# Altium schematic sheet Main.SchDoc
size A; SheetNumber: 1; SheetTotal: 1; SPICEModelCacheQRDTZQRB: <root> / <DocumentId>QRDTZQRB</DocumentId> / <CacheFrame Number="0"> / <Model Name="d_d" Kind="CKT"> / <Text>*$ / .subckt d_d 1 2 / d1 1 2 dd / .model dd d / + is=1e-015 / + n=0.01 / + tt=1e-011 / .ends d_d</Text> / </Model> / <Model Name="tps7a4901_f1" Kind="CKT"> / <Text>*$ / .subckt TPS7A4901_F1 1 2 3 4 / F_F1         3 4 VF_F1 1 / VF_F1         1 2 0V / .ends TPS7A4901_F1</Text> / </Model> / <Model Name="tps7a4901_s2" Kind="CKT"> / <Text>*$ / .subckt TPS7A4901_S2 1 2 3 4 / S_S2         3 4 1 2 _S2 / RS_S2         1 2 1G / .MODEL         _S2 VSWITCH Roff=100 Ron=10 Voff=0.1V Von=0.9V / .ends TPS7A4901_S2</Text> / </Model> / <Model Name="comphys_basic_gen" Kind="CKT"> / <Text>*$ / .SUBCKT COMPHYS_BASIC_GEN INP INM HYS OUT PARAMS: VDD=1 VSS=0 VTHRESH=0.5 / EIN INP1 INM1 INP INM 1 / EHYS INP1 INP2 VALUE { IF( V(1) &gt; {VTHRESH},-V(HYS),0) } / EOUT OUT 0 VALUE { IF( V(INP2)&gt;V(INM1), {VDD} ,{VSS}) } / R1 OUT 1 1 / C1 1 0 5n / RINP1 INP1 0 1K / .ENDS COMPHYS_BASIC_GEN</Text> / </Model> / <Model Name="tps7a4901_trans" Kind="CKT"> / <Text>*$ / *TPS7A4901 / ***************************************************************************** / * (C) Copyright 2017, 2015 Texas Instruments Incorporated. All rights reserved. / ***************************************************************************** / ** This model is designed as an aid for customers of Texas Instruments. / ** TI and its licensors and suppliers make no warranties, either expressed / ** or implied, with respect to this model, including the warranties of / ** merchantability or fitness for a particular purpose. The model is / ** provided solely on an "as is" basis. The entire risk as to its quality / ** and performance is with the customer. / ***************************************************************************** / * / ** Released by: WEBENCH Design Center, Texas Instruments Inc. / * Part: TPS7A4901 / * Date: 28FEB2017 / * Model Type: Transient / * Simulator: PSPICE / * Simulator Version: 16.2.0.p001 / * EVM Order Number: TPS7A30-49EVM-567 / * EVM Users Guide:  SLVU405â€“August 2010 / * Datasheet: SBVS121E â€“AUGUST 2010â€“REVISED MAY 2015 / * / * Model Version: Final 1.2 / * / ***************************************************************************** / * / * Updates:1.2 / *&lt;Made this change to the model&gt; / *          1. Model has been updated to support for inverting configuration. / * / * / * Final 1.1 / * Released to Web / * Updates:1.1 / *&lt;Made this change to the model&gt; / *          1. The model has been updated using New template. / *          2. Dropout measurement done with respect to IOUT / * Final 1.00 / * Released to Web / * / ***************************************************************************** / .SUBCKT TPS7A4901_TRANS  PwPd EN FB IN NC NR DNC OUT GND / R_R13         0 PWPD  1e6 / E_ABM1         N799364 0 VALUE { {MIN(V(N798163), (V(Vzz_INT)+(ILIM*ROUT)))} / +  } / V_Vload         VZZ OUT 0Vdc / X_F1    N506750 VZZ N506376 VYY TPS7A4901_F1 / E_E11         V_FBK 0 VALUE { V(FB, GND) } / R_R1         VXX N506376  {RINP} / R_R11         DNC IN  1e6 / R_R2         N506318 VXX  {PSRR*RINP} / R_R12         GND DNC  1e6 / X_S2    N506546 0 IN N506376 TPS7A4901_S2 / C_C1         VXX N506376  {1/(6.28*RINP*POLE)} / R_U1_R9         U1_N7715581 NR  1m / X_U1_U2         IN_PRE U1_N627863 U1_N6278133 U1_UVLO_OK COMPHYS_BASIC_GEN / +  PARAMS: VDD=1 VSS=0 VTHRESH=0.5 / X_U1_U1         EN_INT U1_N628879 U1_N628829 U1_EN_OK COMPHYS_BASIC_GEN PARAMS: / +  VDD=1 VSS=0 VTHRESH=0.5 / C_U1_C4         0 VIN_EN_OK  1u IC=0 / R_U1_R4         U1_N629335 U1_N628541  10 TC=0,0 / R_U1_R8         U1_N769717 NR  280k TC=0,0 / X_U1_U4         U1_N672242 N506318 d_d PARAMS: / E_U1_E5         U1_N769717 GND VALUE { V(U1_N15847249, 0) } / V_U1_V3         U1_N6278133 0 {UHYS} / X_U1_U3         VIN_EN_OK U1_N630277 d_d PARAMS: / V_U1_V1         U1_N628829 0 {EHYS} / C_U1_C2         0 U1_N628541  1n / C_U1_C3         GND N506318  1n IC=0 / V_U1_V4         U1_N627863 0 {UVLO} / V_U1_V5         GND U1_N672242 -5.5m / V_U1_V2         U1_N628879 0 {VENB} / E_U1_E8         U1_DROP 0 TABLE { V(LOAD, 0) } / + ( (0,0) (0.1m,50m) (5m,80m) (10m,100m) (15m,120m) (150m,330m) ) / C_U1_C5         GND U1_N7715581  1n IC=0 TC=0,0 / E_U1_ABM6         U1_N629219 0 VALUE { IF(V(VIN_EN_OK)&gt;0.5, V(U1_NR_INT), 0) / +  } / R_U1_R2         GND U1_N628541  1G / E_U1_ABM5         U1_N629917 0 VALUE { MIN(V(U1_N628541), / + MAX(V(IN_PRE)-V(U1_DROP), 0))   } / E_U1_E6         U1_NR_INT 0 VALUE { V(NR, GND) } / E_U1_ABM9         U1_N630277 0 VALUE { if( V(U1_UVLO_OK) &gt; 0.5 &amp; V(U1_EN_OK) &gt; / +  0.5,1,0)    } / E_U1_ABM4         U1_N629335 0 VALUE { V(U1_N628493) / + * (ABS(V(OUT_INT)) + 1e-6) / + / (ABS(V(V_FBK)) + 1e-6)  } / R_U1_R3         U1_N629219 U1_N628493  {3.333e5*SQRT(TTRN)} TC=0,0 / R_U1_R1         GND U1_N628493  1G / E_U1_E4         U1_N6294851 GND VALUE { V(U1_N629917, 0) } / E_U1_ABM10         U1_N15847249 0 VALUE { IF(V(VIN_EN_OK)&gt;0.5,{VREF},0)    } / R_U1_R6         U1_N630277 VIN_EN_OK  {80/0.693} TC=0,0 / C_U1_C1         0 U1_N628493  {1e-6*SQRT(TTRN)} IC=0 / R_U1_R5         U1_N6294851 N506318  10 TC=0,0 / R_R14         0 PWPD  1e6 / C_C2         VXX N506318  {1/(6.28*PSRR*RINP*ZERO)} / R_R9         NC IN  1e6 / R_R6         N506754 VYY  10 TC=0,0 / E_E6         IN_PRE 0 VALUE { V(IN, GND) } / E_ABM2         LOAD 0 VALUE { I(V_Vload)    } / E_E15         OUT_INT 0 VALUE { V(OUT, GND) } / X_U4         GND OUT d_d PARAMS: / C_C5         N506376 GND  0.5n IC=0 / R_R5         N506750 VYY  {ROUT} / C_C3         GND VYY  1n / R_R8         VIN_EN_OK N506546  10 TC=0,0 / R_R10         GND NC  1e6 / E_E12         N798163 0 VALUE { V(VXX, GND) } / E_E14         VZZ_INT 0 VALUE { V(VZZ, GND) } / E_E5         EN_INT 0 VALUE { V(EN, GND) } / C_C4         0 N506546  1u / E_E13         N506754 GND VALUE { V(N799364, 0) } / .PARAM  psrr=224u uvlo=2.95 venb=2.1 ilim=390m pole=500 zero=100k rinp=1e7 / +  ttrn=1u rout=1m vref=1.192 ehys=1.7 uhys=0.05 / .ENDS TPS7A4901_TRANS</Text> / <Dependency>0\d_d</Dependency> / <Dependency>0\tps7a4901_f1</Dependency> / <Dependency>0\tps7a4901_s2</Dependency> / <Dependency>0\comphys_basic_gen</Dependency> / </Model> / <Model Name="skydiode" Kind="MDL"> / <Text>*Default Schottky Diode / *Schottky Diode Pinout: A,K / .MODEL SKYDIODE D(EG=0.69 XTI=2)</Text> / </Model> / </CacheFrame> / </root>
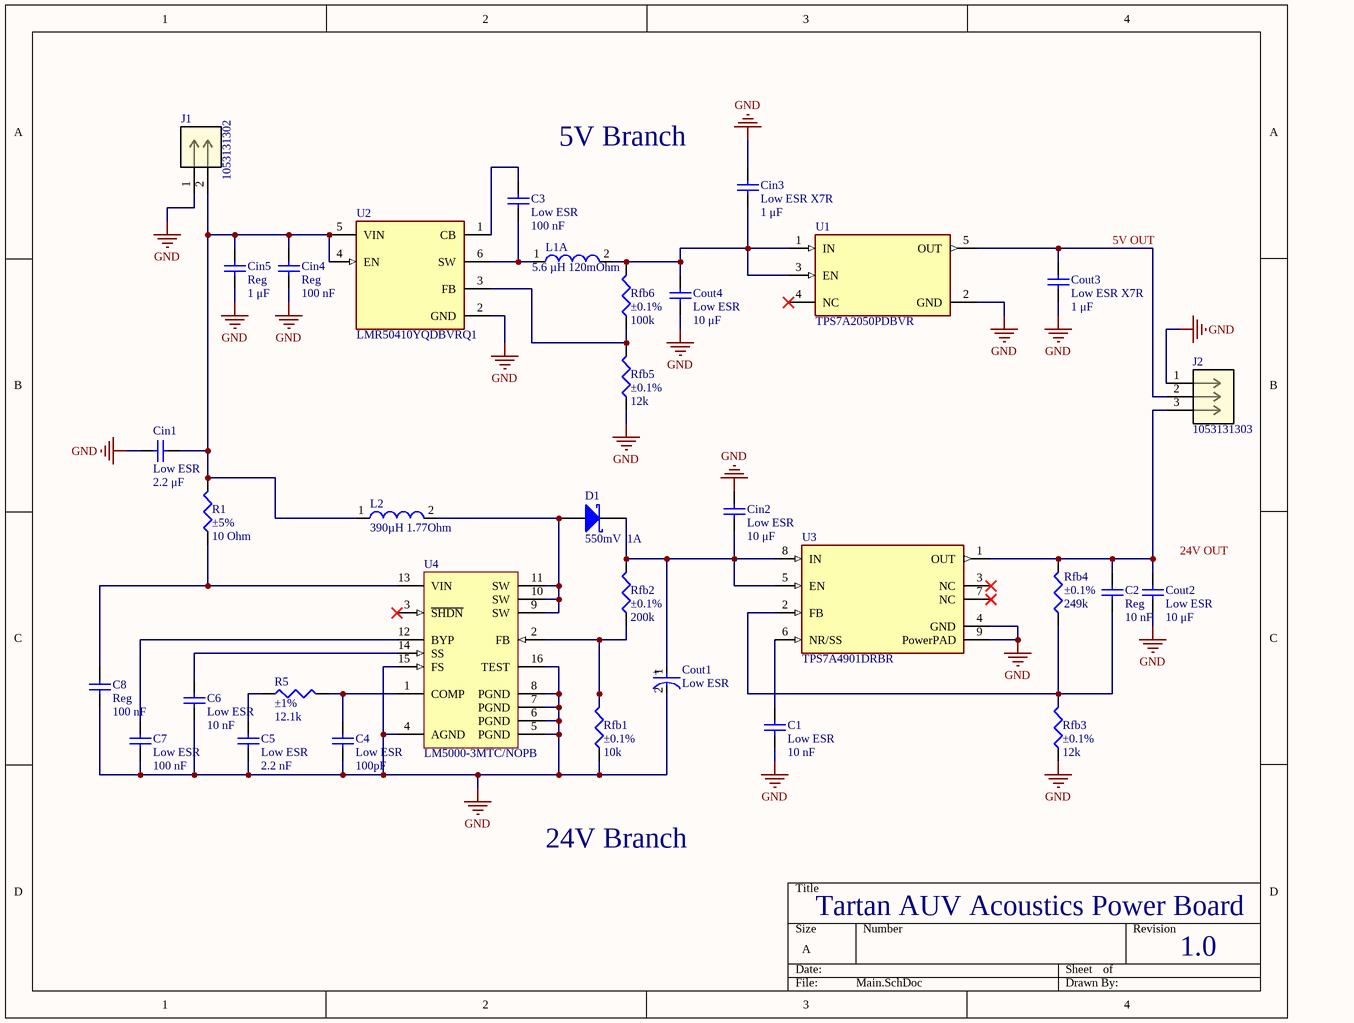
[diagram p0: Main.SchDoc]

## Parts
C1  Low ESR  value 10 nF  [C0805]
C2  Reg  value 10 nF  [C0805]
C3  Low ESR  value 100 nF  [C0805]
C4  Low ESR  value 100pF  [C0805]
C5  Low ESR  value 2.2 nF  [C0805]
C6  Low ESR  value 10 nF  [C0805]
C7  Low ESR  value 100 nF  [C0805]
C8  Reg  value 100 nF  [C0805]
Cin1  Low ESR  value 2.2 μF  [C0805]
Cin2  Low ESR  value 10 μF  [C1210]
Cin3  Low ESR X7R  value 1 μF  [C0805]
Cin4  Reg  value 100 nF  [C0805]
Cin5  Reg  value 1 μF  [C0805]
Cout1  Low ESR  [FP-EEH-D8-MFG]
Cout2  Low ESR  value 10 μF  [C1210]
Cout3  Low ESR X7R  value 1 μF  [C0805]
Cout4  Low ESR  value 10 μF  [C1210]
D1  550mV  1A  [SMB]
J1  1053131302  [CON_1053131302]
J2  1053131303  [CON_1053131303]
L1  5.6 µH 120mOhm  [WE-TPC-8012]  (part A of 2)
L2  390µH 1.77Ohm  [WE-PD2-L]
R1  ±5%  value 10 Ohm  [J1-0603]
R5  ±1%  value 12.1k  [J1-0603]
Rfb1  ±0.1%  value 10k  [J1-0603]
Rfb2  ±0.1%  value 200k  [J1-0603]
Rfb3  ±0.1%  value 12k  [J1-0603]
Rfb4  ±0.1%  value 249k  [J1-0603]
Rfb5  ±0.1%  value 12k  [J1-0603]
Rfb6  ±0.1%  value 100k  [J1-0603]
U1  TPS7A2050PDBVR  [FP-DBV0005A-IPC_B]
U2  LMR50410YQDBVRQ1  [FP-DBV0006A-MFG]
U3  TPS7A4901DRBR  [FP-DRB0008A-MFG]
U4  LM5000-3MTC/NOPB  [PW0016A_L]

## Nets
GND: C1.1 C4.1 C5.1 C6.1 C7.1 C8.1 Cin1.1 Cin2.2 Cin3.2 Cin4.1 Cin5.1 Cout1.2(A) Cout2.1 Cout3.1 Cout4.1 J1.1 J2.1 Rfb1.1 Rfb3.1 Rfb5.1 U1.2(GND) U2.2(GND) U3.4(GND) U3.9(PowerPAD) U4.4(AGND) U4.5(PGND) U4.6(PGND) U4.7(PGND) U4.8(PGND) U4.15(FS) U4.16(TEST)
NetC1_2: C1.2 U3.6(NR/SS)
NetC2_1: C2.1 Rfb3.2 Rfb4.1 U3.2(FB)
NetC2_2: C2.2 Cout2.2 J2.3 Rfb4.2 U3.1(OUT)
NetC3_1: C3.1 L1.1 U2.6(SW)
NetC3_2: C3.2 U2.1(CB)
NetC4_2: C4.2 R5.2 U4.1(COMP)
NetC5_2: C5.2 R5.1
NetC6_2: C6.2 U4.14(SS)
NetC7_2: C7.2 U4.12(BYP)
NetC8_2: C8.2 R1.1 U4.13(VIN)
NetCin1_2: Cin1.2 Cin4.2 Cin5.2 J1.2 L2.1 R1.2 U2.4(EN) U2.5(VIN)
NetCin2_1: Cin2.1 Cout1.1(C) D1.2(K) Rfb2.2 U3.5(EN) U3.8(IN)
NetCin3_1: Cin3.1 Cout4.2 L1.2 Rfb6.2 U1.1(IN) U1.3(EN)
NetCout3_2: Cout3.2 J2.2 U1.5(OUT)
NetD1_1: D1.1(A) L2.2 U4.9(SW) U4.10(SW) U4.11(SW)
NetRfb1_2: Rfb1.2 Rfb2.1 U4.2(FB)
NetRfb5_2: Rfb5.2 Rfb6.1 U2.3(FB)

Not connected (* = marked no-connect by the designer): U1 4(NC)*; U3 3(NC)* 7(NC)*; U4 3(~{SHDN})*

## Notes on the sheet
- 5V Branch
- 5V OUT
- (near Cout2) 24V OUT
- 24V Branch
- Tartan AUV Acoustics Power Board
- 1.0
- (in symbol CMP-05428-001211-1) +

## Library data of the parts
C1-C8 Cin1-Cin5 Cout2-Cout4 = Cap: Capacitor; Published: 8-Jun-2000; LatestRevisionDate: 17-Jul-2002; LatestRevisionNote: Re-released for DXP Platform.; PackageReference: RAD-0.3; Publisher: Altium Limited; PackageDescription: Radial Cap, Thru-Hole; 2 Leads; 0.3 in Pin Spacing
Cout1 = CMP-05428-001211-1: Conductive Polymer Hybrid Aluminum Electrolytic Capacitors 68uF ±20% 35V RADIAL SMT 6.3x7.7mm; Leakage Current: 23.8uA; Ripple Current (AC): 2A; Polarity: Polar; Life (Hours): 5000Hour; ESR (Equivalent Series Resistance): 35mR; Lead Diameter: 0.65mm; Termination: SMD/SMT; Case/Package: Radial; Package Quantity: 900; Radiation Hardening: No; Max Operating Temperature: 105°C; Capacitance: 68uF; Voltage Rating: 35V; Number of Pins: 8; Mount: Surface Mount; Technology: HYBRID; Diameter: 6.3mm; Min Operating Temperature: -55°C; Length: 7.7mm; Ratings: AEC-Q200; Height - Seated (Max): 0.315inch; Ripple Current: 2A; Lead Free: Lead Free; Voltage: 35V; Lead Pitch: 1.8mm; Voltage Rating (DC): 35V; REACH SVHC: No SVHC; Material: Polymer; Height: 7.7mm; Tolerance: 20%; Construction: Cylindrical; Packaging: Tape and Reel; Series: ZA
D1 = D Schottky: Schottky Diode; Published: 8-Jun-2000; LatestRevisionDate: 17-Jul-2002; LatestRevisionNote: Re-released for DXP Platform.; PackageReference: SMB; Publisher: Altium Limited; PackageDescription: DO-214-AA/SMB; 2 C-Bend Leads; Body 5.3 x 3.6 mm, inc. leads (LxW); Code_JEDEC: DO-214-AA
J1 = 1053131302: No Description Available; Mfr_Name: Molex Connector Corporation; Copyright: Copyright (C) 2022 Ultra Librarian. All rights reserved.; Manufacturer_Part_Number: 1053131302; RefDes: RefDes; Type: DEV
J2 = 1053131303: No Description Available; Mfr_Name: Molex Connector Corporation; Copyright: Copyright (C) 2022 Ultra Librarian. All rights reserved.; Manufacturer_Part_Number: 1053131303; RefDes: RefDes; Type: DEV
L1 = CMP-0227-00263-1: SMD Shielded Tiny Power Inductor WE-TPC, L = 5.60 µH; Inductance: 5.60 ÂµH; ComponentLink2Description: Datasheet; PackageDescription: SMD Inductor, 2-Leads, Body 8.0 x 8.0 mm; PackageVersion: 2009; PackageReference: WE-TPC-8012; ComponentLink1Description: Manufacturer Link; ComponentLink2URL: http://www.we-online.de/katalog/media/pdf/7440680056.pdf; ComponentLink1URL: http://www.we-online.com; DatasheetVersion: ver 1, Apr-2009
L2 = CMP-0227-00449-1: SMD Power Inductor WE-PD2, L = 390 µH; Inductance: 390 ÂµH; ComponentLink1URL: http://www.we-online.com; DatasheetVersion: ver 1, Oct-2004; PackageReference: WE-PD2-L; PackageVersion: 2004; ComponentLink2URL: http://www.we-online.de/katalog/media/pdf/744775239.pdf; PackageDescription: SMD Inductor, 2-Leads, Body 7.8 x 7.0 mm; ComponentLink1Description: Manufacturer Link; ComponentLink2Description: Datasheet
R1 R5 Rfb1-Rfb6 = Res3: Resistor; Published: 8-Jun-2000; LatestRevisionDate: 29-May-2009; LatestRevisionNote: IPC-7351 Footprint Added.; PackageReference: J1-0603; Publisher: Altium Limited; PackageDescription: Chip Resistor
U1 = CMP-04917-000115-1: 300-mA, ultra-low-noise, low-IQ, low-dropout (LDO) linear regulator with high PSRR 5-SOT-23 -40 to 125; RoHS Compliant: Yes
U2 = CMP-04918-000478-1: NIXON PLUS-LMR50410YQDBVRQ1
U3 = CMP-04917-000048-2: None; Polarity: Positive; Max Input Voltage: 35V; Output Type: Adjustable; Output Voltage: 33V; Number of Regulators: 1; Quiescent Current: 100uA; Output Current: 150mA; Accuracy: 1.5%; Dropout Voltage: 333mV; Min Current Limit: 220mA; Min Input Voltage: 3V; Max Operating Temperature: 125°C; Min Operating Temperature: -40°C; Lead Free: Lead Free; Number of Pins: 8; Mount: Surface Mount; Packaging: Cut Tape; Number of Outputs: 1; RoHS Compliant: Yes; Contact Plating: Gold; Max Output Current: 150mA
U4 = CMP-0069-01337-3: High Voltage Switch Mode Regulator, 16-pin TSSOP, Pb-Free; Manufacturer: Texas Instruments; PowerWise: N; CompType: Switcher; PackageTopMarking: NSZXYTT*LM5000*3MTC; PackageReference: PW0016A; Code_JEDEC: MO-153-AB; PinCount: 16; RoHS: Y; ComponentLink1URL: http://www.ti.com/general/docs/lit/getliterature.tsp?genericPartNumber=LM5000&fileType=pdf; PackageDescription: Molded TSSOP, Jedec, 5 x 4.4 x 0.9mm Body, 16 Lead, 0.65mm Pitch; ComponentLink1Description: Datasheet URL